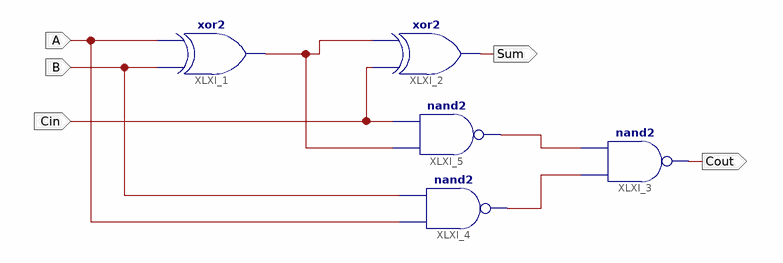
[diagram p0: schematic sheet 1]
// Xilinx ISE schematic FA.sch (spartan3e) as structural Verilog: 5 symbols, 5 ports
module FA (
  input  A,
  input  B,
  input  Cin,
  output Sum,
  output Cout
);

  wire XLXN_7, XLXN_11, XLXN_15;

  xor XLXI_1 (XLXN_7, B, A);
  xor XLXI_2 (Sum, Cin, XLXN_7);
  nand XLXI_3 (Cout, XLXN_11, XLXN_15);
  nand XLXI_4 (XLXN_11, A, B);
  nand XLXI_5 (XLXN_15, XLXN_7, Cin);
endmodule
